# EAGLE design SAFE-MSP (EAGLE 6.3)
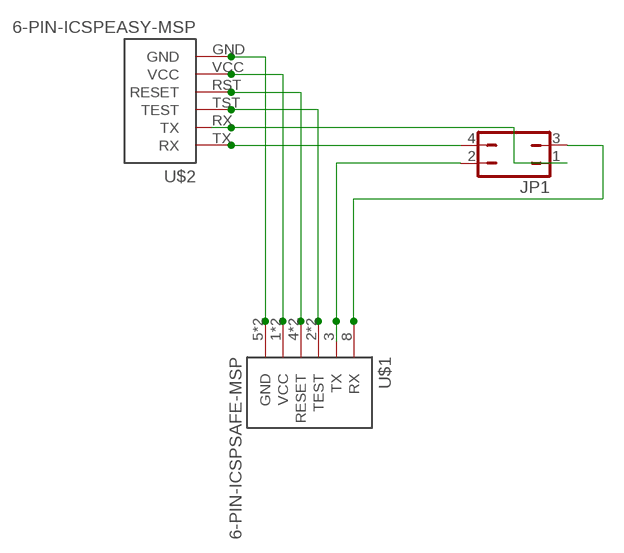
[diagram p0: schematic, sheet 1]

## Parts
JP1  JP2Q  [JP2Q]
U$1  6-PIN-ICSPSAFE-MSP  [SAFEMSP]
U$2  6-PIN-ICSPEASY-MSP  [EASYMSP-6PIN]

## Nets
GND: U$1.5(GND) U$1.10(GND) U$2.GND
RST: U$1.4(RESET) U$1.9(RESET) U$2.RST(RESET)
RX_FET: JP1.4 U$2.TX(RX)
RX_TARGET: JP1.3 U$1.8(RX)
TST: U$1.2(TEST) U$1.7(TEST) U$2.TST(TEST)
TX_FET: JP1.1 U$2.RX(TX)
TX_TARGET: JP1.2 U$1.3(TX)
VCC: U$1.1(VCC) U$1.6(VCC) U$2.VCC

## Library data of the parts
JP1 = jumper:JP2Q: JUMPER
U$1 U$2 = LaunchFET:6-PIN-ICSP: 6 pin easy-msp formatted headers. Designed to make programming target boards with MSP430 Launchpad easier. EASYMSP: standard .05" pitch header to match launchpad SAFEMSP: .05" header with .025" offset Vcc to keep Geordi away

## Board
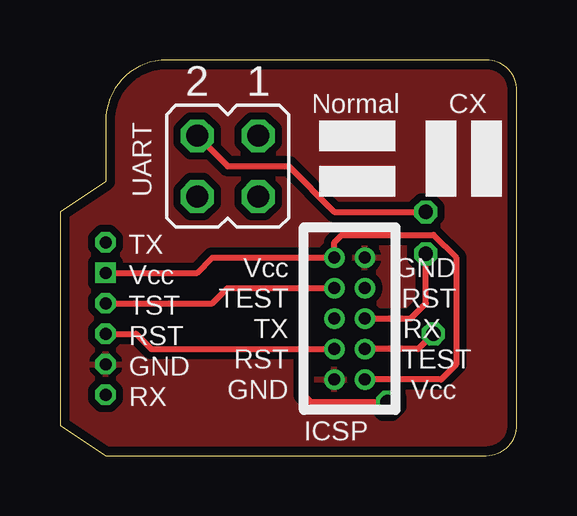
[diagram p1: board, top side]
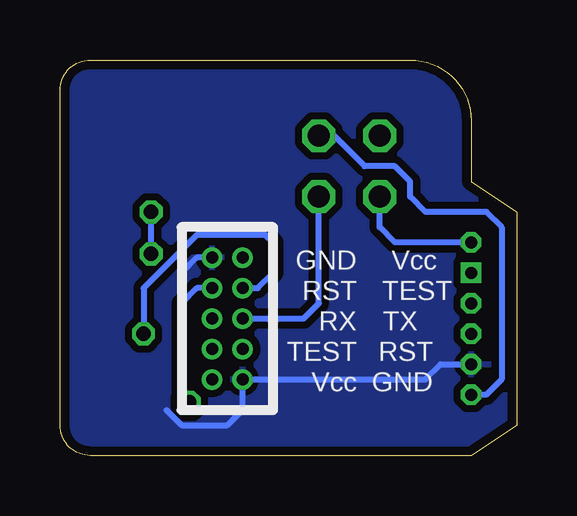
[diagram p2: board, bottom side, seen from below]

Size 19.04 x 16.5 mm. Coordinates in mm from the lower left corner, seen from the top.
Outline: 1.91,0 17.77,0 arc90 19.04,1.27 19.04,15.23 arc90 17.77,16.5 4.45,16.5 arc90 1.91,13.96 1.91,11.43 0,10.16 0,1.27 1.91,0
Copper layers (1*16): Top 0.0356mm / dielectric 1.5011mm / Bottom 0.0356mm
Design rules "oshpark": minimum track width 6mil, minimum drill 13mil, track to track 6mil, track to pad 6mil, pad to pad 6mil, via to via 6mil, smd to smd 6mil, copper to edge 15mil, drill to drill 6mil, minimum pad ring 7mil, minimum via ring 7mil, stop-mask expansion 4mil, vias tented up to drill 0mil, thermal gap 10mil

### Footprints (pad centres in the part's own frame; a part is rotated, then mirrored left to right if it is on the bottom)
JP2Q = drill 0.914 octagon: 1 -1.27,-1.27; 2 -1.27,1.27; 3 1.27,-1.27; 4 1.27,1.27
SAFEMSP = drill 0.5: 1 0,5.08; 2 0,3.81; 3 0,2.54; 4 0,1.27; 5 0,0; 6 1.27,0; 7 1.27,1.27; 8 1.27,2.54; 9 1.27,3.81; 10 1.27,5.08
EASYMSP-6PIN = drill 0.5 octagon: GND 0,-1.27; RST 0,0; RX 0,-2.54; TST 0,1.27; TX 0,3.81 | drill 0.5 square: VCC 0,2.54

### Placement (x,y rotation side)
JP1  6.99,12.06 180 top
U$1  11.43,3.17 0 top
U$2  1.91,5.08 0 top

### Tracks (layer width: path | path; a pad name or v marks a point on that pad's centre or on a via)
GND
  Bottom 0.254: U$2.GND 3.17,3.81 3.81,3.17 U$1.5 11.43,1.91 12.06,1.27 13.97,1.27 14.61,1.91 | U$1.10 13.34,8.26 13.97,7.62
  pour Top (isolate 0.305): 0,0 0,16.51 17.78,16.51 arc-90 19.05,15.24 19.05,1.27 arc-90 17.78,0
  pour Bottom (isolate 0.305): 0,0 0,16.51 17.78,16.51 arc-90 19.05,15.24 19.05,1.27 arc-90 17.78,0
RST  (via drill 0.6)
  Top 0.254: U$2.RST 3.17,5.08 3.81,4.45 10.16,4.45 | 10.16,4.45 U$1.4 | v13.65,2.22 10.48,2.22 10.16,2.54 10.16,4.45
  Bottom 0.254: U$1.9 13.34,6.99 13.97,6.35 13.97,2.54 v13.65,2.22
RX_FET
  Bottom 0.254: U$2.TX 5.08,8.89 5.71,9.53 JP1.4
RX_TARGET  (via drill 0.6)
  Top 0.254: JP1.3 6.99,12.06 9.53,12.06 11.43,10.16 v15.24,10.16 | U$1.8 14.61,5.71 15.24,6.35 v15.24,8.41
  Bottom 0.254: v15.24,8.41 v15.24,10.16
TST  (via drill 0.6)
  Top 0.254: U$2.TST 6.35,6.35 6.99,6.99 U$1.2 | v15.56,5.08 14.92,4.45 U$1.7
  Bottom 0.254: U$1.2 10.79,6.99 10.16,7.62 10.16,8.89 10.48,9.21 13.34,9.21 15.56,6.99 v15.56,5.08
TX_FET
  Bottom 0.254: JP1.1 7.62,13.34 6.35,12.06 5.08,12.06 4.45,11.43 4.45,10.79 3.81,10.16 1.27,10.16 0.64,9.53 0.64,3.17 1.27,2.54 U$2.RX
TX_TARGET
  Bottom 0.254: U$1.3 8.89,5.71 8.26,6.35 JP1.2
VCC
  Top 0.254: U$2.VCC 5.71,7.62 6.35,8.26 U$1.1 11.43,8.89 11.75,9.21 15.56,9.21 16.51,8.26 16.51,3.81 15.88,3.17 U$1.6

### Text on the board
_tsilk: Normal | CX | UART
_bsilk: Vcc | GND | TEST | RST | TX | RX | RST | TEST | GND | Vcc